# Altium schematic sheet CH32V205V-R0.SchDoc
size A3; SheetNumber: 1; SheetTotal: 1
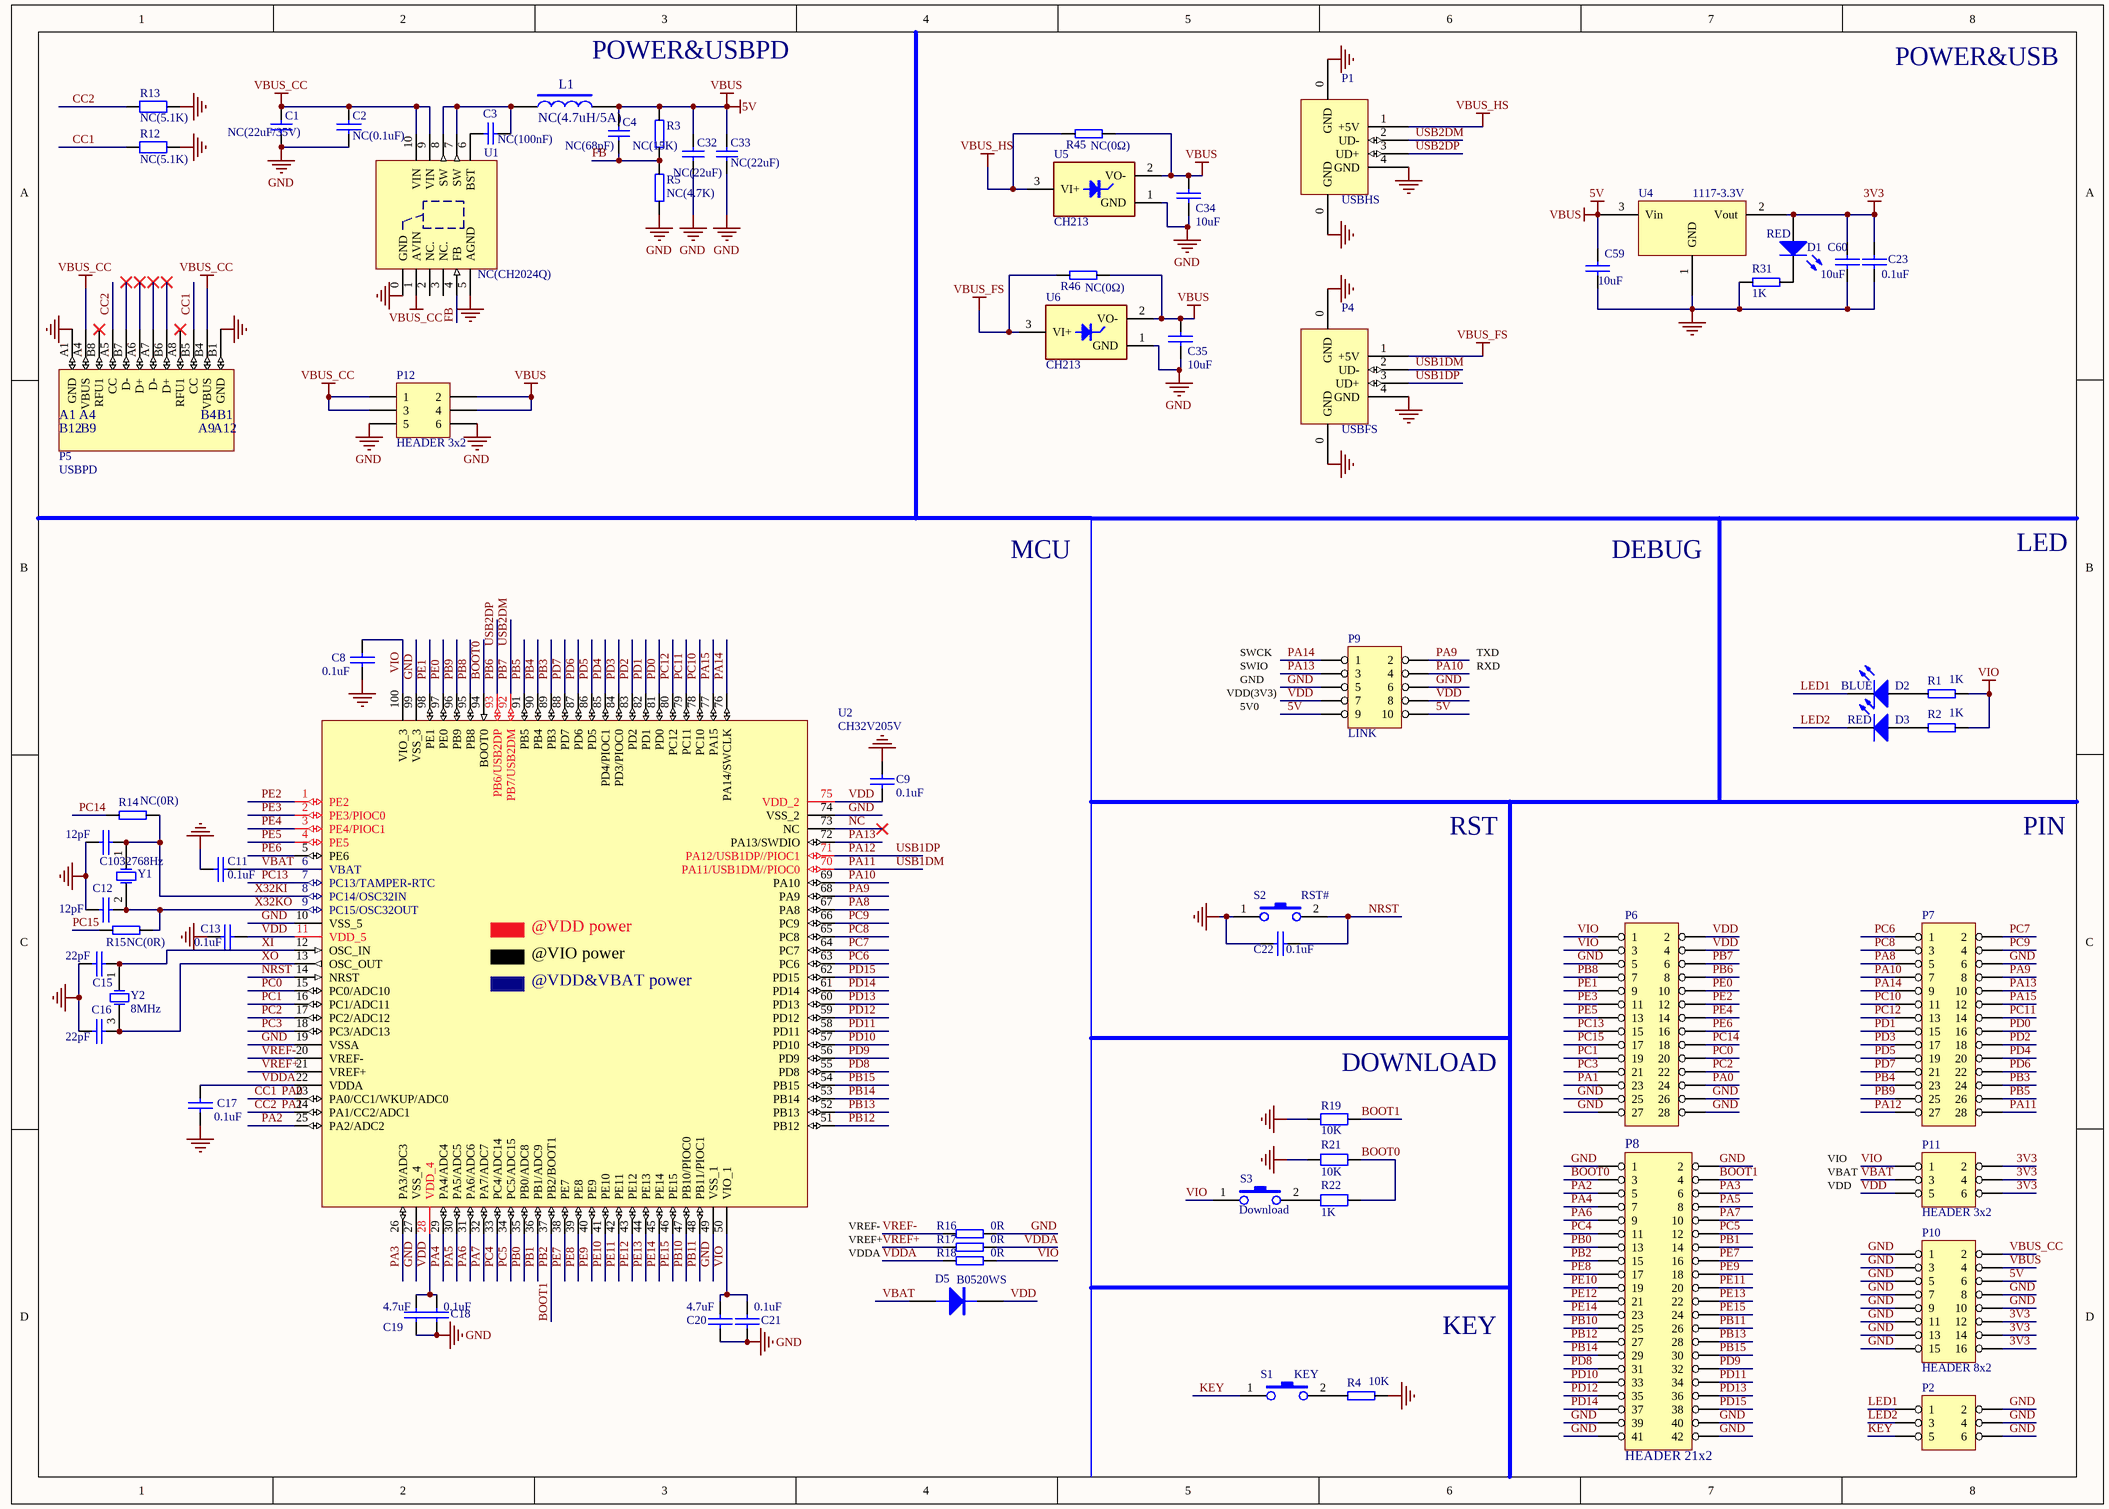
[diagram p0: CH32V205V-R0.SchDoc]

## Parts
C1  NC(22uF/35V)  [0805_C]
C2  NC(0.1uF)  [0402_C]
C3  NC(100nF)  [0402_C]
C4  NC(68pF)  [0402_C]
C8  0.1uF  [0402_C]
C9  0.1uF  [0402_C]
C10  12pF  [0402_C]
C11  0.1uF  [0402_C]
C12  12pF  [0402_C]
C13  0.1uF  [0402_C]
C15  22pF  [0402_C]
C16  22pF  [0402_C]
C17  0.1uF  [0402_C]
C18  0.1uF  [0402_C]
C19  4.7uF  [0402_C]
C20  4.7uF  [0402_C]
C21  0.1uF  [0402_C]
C22  0.1uF  [0402_C]
C23  0.1uF  [0402_C]
C32  NC(22uF)  [0805_C]
C33  NC(22uF)  [0805_C]
C34  10uF  [0603_C]
C35  10uF  [0603_C]
C59  10uF  [0603_C]
C60  10uF  [0603_C]
D1  RED  [0603+]
D2  BLUE  [0603+]
D3  RED  [0603+]
D5  B0520WS  [SOD-323]
L1  NC(4.7uH/5A)  [IND-SMD_L7.0-W6.6]
P1  USBHS  [USBAF]
P2  IO  [IDC6-2.54mm]  (value not drawn)
P4  USBFS  [USBAF]
P5  USBPD  [TYPE-C-Receptacle-2.0]
P6  (no value)  [IDC28-2.54MM]
P7  (no value)  [IDC28-2.54MM]
P8  HEADER 21x2  [IDC42-2.54MM]
P9  LINK  [IDC10-2.54mm]
P10  HEADER 8x2  [IDC16-2.54mm]
P11  HEADER 3x2  [IDC6-2.54mm]
P12  HEADER 3x2  [IDC6-2.54mm]
R1  1K  [0402]
R2  1K  [0402]
R3  NC(15K)  [0402]
R4  10K  [0402]
R5  NC(4.7K)  [0402]
R12  NC(5.1K)  [0402]
R13  NC(5.1K)  [0402]
R14  NC(0R)  [0402]
R15  NC(0R)  [0402]
R16  0R  [0402]
R17  0R  [0402]
R18  0R  [0402]
R19  10K  [0402]
R21  10K  [0402]
R22  1K  [0402]
R31  1K  [0402]
R45  NC(0Ω)  [0402]
R46  NC(0Ω)  [0402]
S1  KEY  [SMD_6.1x3.65x2.5mm-KEY]
S2  RST#  [SMD_6.1x3.65x2.5mm-KEY]
S3  Download  [SMD_6.1x3.65x2.5mm-KEY]
U1  NC(CH2024Q)  [DFN10_3X3]
U2  CH32V205V  [LQFP100]
U4  1117-3.3V  [SOT-223]
U5  CH213  [SOT-23-3]
U6  CH213  [SOT-23-3]
Y1  32768Hz  [FC-135]
Y2  8MHz  [XT3225]

## Nets
3V3: C23.1 C60.1 D1.1(A) P10.12 P10.14 P10.16 P11.2 P11.4 P11.6 U4.2(Vout)
5V: C4.1 C32.2 C33.2 C34.1 C35.1 C59.1 L1.2 P9.9 P9.10 P10.4 P10.6 P12.2 P12.4 R3.2 R45.1 R46.1 U4.3(Vin) U5.2(VO-) U6.2(VO-)  [also labelled VBUS]
GND: C1.1 C2.1 C8.1 C9.2 C10.1 C11.1 C12.1 C13.2 C15.1 C16.1 C17.2 C18.1 C19.2 C20.2 C21.2 C22.1 C23.2 C32.1 C33.1 C34.2 C35.2 C59.2 C60.2 P1.0(GND) P1.4(GND) P2.2 P2.4 P2.6 P4.0(GND) P4.4(GND) P5.A1(GND) P5.B1(GND) P6.5 P6.25 P6.26 P6.27 P6.28 P7.6 P8.1 P8.2 P8.39 P8.40 P8.41 P8.42 P9.5 P9.6 P10.1 P10.3 P10.5 P10.7 P10.8 P10.9 P10.10 P10.11 P10.13 P10.15 P12.5 P12.6 R4.1 R5.1 R12.2 R13.2 R16.1 R19.2 R21.2 R31.1 S2.1 U1.0(GND) U1.5(AGND) U2.10(VSS_5) U2.19(VSSA) U2.27(VSS_4) U2.49(VSS_1) U2.74(VSS_2) U2.99(VSS_3) U4.1(GND) U5.1(GND) U6.1(GND)
VBUS_CC: C1.2 C2.2 P5.A4(VBUS) P5.B4(VBUS) P10.2 P12.1 P12.3 U1.1(AVIN) U1.9(VIN) U1.10(VIN)
VBUS_FS: P4.1(+5V) R46.2 U6.3(VI+)
VBUS_HS: P1.1(+5V) R45.2 U5.3(VI+)
VIO: C8.2 C20.1 C21.1 P6.1 P6.3 P11.1 R1.1 R2.1 R18.1 S3.1 U2.50(VIO_1) U2.100(VIO_3)
BOOT0: P8.3 R21.1 R22.1 U2.94(BOOT0)
BOOT1: P8.4 P8.15 R19.1 U2.37(PB2/BOOT1)  [also labelled PB2]
CC1: P5.B5(CC) P6.24 R12.1 U2.23(PA0/CC1/WKUP/ADC0)  [also labelled PA0]
CC2: P5.A5(CC) P6.23 R13.1 U2.24(PA1/CC2/ADC1)  [also labelled PA1]
FB: C4.2 R3.1 R5.2 U1.4(FB)
KEY: P2.5 S1.1
LED1: D2.2(K) P2.1
LED2: D3.2(K) P2.3
NC: U2.73(NC)
NRST: C22.2 S2.2 U2.14(NRST)
PA2: P8.5 U2.25(PA2/ADC2)
PA3: P8.6 U2.26(PA3/ADC3)
PA4: P8.7 U2.29(PA4/ADC4)
PA5: P8.8 U2.30(PA5/ADC5)
PA6: P8.9 U2.31(PA6/ADC6)
PA7: P8.10 U2.32(PA7/ADC7)
PA8: P7.5 U2.67(PA8)
PA9: P7.8 P9.2 U2.68(PA9)
PA10: P7.7 P9.4 U2.69(PA10)
PA11: P4.2(UD-) P7.28 U2.70(PA11/USB1DM//PIOC0)  [also labelled USB1DM]
PA12: P4.3(UD+) P7.27 U2.71(PA12/USB1DP//PIOC1)  [also labelled USB1DP]
PA13: P7.10 P9.3 U2.72(PA13/SWDIO)
PA14: P7.9 P9.1 U2.76(PA14/SWCLK)
PA15: P7.12 U2.77(PA15)
PB0: P8.13 U2.35(PB0/ADC8)
PB1: P8.14 U2.36(PB1/ADC9)
PB3: P7.24 U2.89(PB3)
PB4: P7.23 U2.90(PB4)
PB5: P7.26 U2.91(PB5)
PB6: P1.3(UD+) P6.8 U2.93(PB6/USB2DP)  [also labelled USB2DP]
PB7: P1.2(UD-) P6.6 U2.92(PB7/USB2DM)  [also labelled USB2DM]
PB8: P6.7 U2.95(PB8)
PB9: P7.25 U2.96(PB9)
PB10: P8.25 U2.47(PB10/PIOC0)
PB11: P8.26 U2.48(PB11/PIOC1)
PB12: P8.27 U2.51(PB12)
PB13: P8.28 U2.52(PB13)
PB14: P8.29 U2.53(PB14)
PB15: P8.30 U2.54(PB15)
PC0: P6.20 U2.15(PC0/ADC10)
PC1: P6.19 U2.16(PC1/ADC11)
PC2: P6.22 U2.17(PC2/ADC12)
PC3: P6.21 U2.18(PC3/ADC13)
PC4: P8.11 U2.33(PC4/ADC14)
PC5: P8.12 U2.34(PC5/ADC15)
PC6: P7.1 U2.63(PC6)
PC7: P7.2 U2.64(PC7)
PC8: P7.3 U2.65(PC8)
PC9: P7.4 U2.66(PC9)
PC10: P7.11 U2.78(PC10)
PC11: P7.14 U2.79(PC11)
PC12: P7.13 U2.80(PC12)
PC13: P6.15 U2.7(PC13/TAMPER-RTC)
PC14: P6.18 R14.1
PC15: P6.17 R15.1
PD0: P7.16 U2.81(PD0)
PD1: P7.15 U2.82(PD1)
PD2: P7.18 U2.83(PD2)
PD3: P7.17 U2.84(PD3/PIOC0)
PD4: P7.20 U2.85(PD4/PIOC1)
PD5: P7.19 U2.86(PD5)
PD6: P7.22 U2.87(PD6)
PD7: P7.21 U2.88(PD7)
PD8: P8.31 U2.55(PD8)
PD9: P8.32 U2.56(PD9)
PD10: P8.33 U2.57(PD10)
PD11: P8.34 U2.58(PD11)
PD12: P8.35 U2.59(PD12)
PD13: P8.36 U2.60(PD13)
PD14: P8.37 U2.61(PD14)
PD15: P8.38 U2.62(PD15)
PE0: P6.10 U2.97(PE0)
PE1: P6.9 U2.98(PE1)
PE2: P6.12 U2.1(PE2)
PE3: P6.11 U2.2(PE3/PIOC0)
PE4: P6.14 U2.3(PE4/PIOC1)
PE5: P6.13 U2.4(PE5)
PE6: P6.16 U2.5(PE6)
PE7: P8.16 U2.38(PE7)
PE8: P8.17 U2.39(PE8)
PE9: P8.18 U2.40(PE9)
PE10: P8.19 U2.41(PE10)
PE11: P8.20 U2.42(PE11)
PE12: P8.21 U2.43(PE12)
PE13: P8.22 U2.44(PE13)
PE14: P8.23 U2.45(PE14)
PE15: P8.24 U2.46(PE15)
VBAT: C11.2 D5.1(A) P11.3 U2.6(VBAT)
VDD: C9.1 C13.1 C18.2 C19.1 D5.2(K) P6.2 P6.4 P9.7 P9.8 P11.5 U2.11(VDD_5) U2.28(VDD_4) U2.75(VDD_2)
VDDA: C17.1 R17.1 R18.2 U2.22(VDDA)
VREF+: R17.2 U2.21(VREF+)
VREF-: R16.2 U2.20(VREF-)
X32KI: C10.2 R14.2 U2.8(PC14/OSC32IN) Y1.1(OSC1)
X32KO: C12.2 R15.2 U2.9(PC15/OSC32OUT) Y1.2(OSC2)
XI: C15.2 U2.12(OSC_IN) Y2.1(OSC1)
XO: C16.2 U2.13(OSC_OUT) Y2.3(OSC2)
NetC3_1: C3.1 U1.6(BST)
NetC3_2: C3.2 L1.1 U1.7(SW) U1.8(SW)
NetD1_2: D1.2(K) R31.2
NetD2_1: D2.1(A) R1.2
NetD3_1: D3.1(A) R2.2
NetR4_2: R4.2 S1.2
NetR22_2: R22.2 S3.2

Not connected (* = marked no-connect by the designer): P5 A6(D+)* A7(D-)* A8(RFU1)* B6(D+)* B7(D-)* B8(RFU1)*; U1 2(NC.) 3(NC.)

## Notes on the sheet
- POWER&USBPD
- POWER&USB
- MCU
- DEBUG
- LED
- VDD(3V3)
- SWCK
- SWIO
- 5V0
- GND
- TXD
- RXD
- RST
- PIN
- (near R19) DOWNLOAD
- VIO
- VBAT
- VDD
- (near U2) VREF-
- (near U2) VREF+
- VDDA
- KEY
- (in symbol CH32V205V) @VDD power; @VIO power; @VDD&VBAT power
- (in symbol TYPE-C1) B12; B9; A9; A12

## Library data of the parts
C1 C4 C32 C33 = 0603 100nF (104) 10% 50V: 贴片电容; ComponentLink1Description: 供应商链接; ComponentLink1URL: http://www.szlcsc.com/product/details_15331.html; Package: 0603; Supplier: LC; SuppliersPartNumber: C14663
C2 C8-C13 C15-C23 C34 C35 C59 C60 = CAP: Capacitor
C3 = 0603 1uF (105) 10% 50V: 贴片电容; ComponentLink1Description: 供应商链接; ComponentLink1URL: http://www.szlcsc.com/product/details_16531.html; Package: 0603; Supplier: LC; SuppliersPartNumber: C15849
D1-D3 = LED0: Typical INFRARED GaAs LED; Published: 8-Jun-2000; LatestRevisionDate: 08-Jul-2005; LatestRevisionNote: Mech Layer 1 removed.; PackageReference: LED-0; Publisher: Altium Limited; PackageDescription: LED; 2 Leads
D5 = DIODE
L1 = INDUCTOR
P1 P4 = USB: USB Port
P2 P11 P12 = HEADER 3x2: Header, 3-Pin, Dual row
P5 = TYPE-C1
P6 P7 = HEADER 14x2: Header, 14-Pin, Dual row
P8 = HEADER 21x2: Header, 21-Pin, Dual row
P9 = HEADER 5x2: Header, 5-Pin, Dual row
P10 = HEADER 8x2: Header, 8-Pin, Dual row
R1-R5 R14 R15 R31 R45 R46 = RES
R12 R13 R19 R21 R22 = Res2: Resistor
  R19 R21: Published: 8-Jun-2000; LatestRevisionDate: 17-Jul-2002; LatestRevisionNote: Re-released for DXP Platform.; PackageReference: AXIAL-0.4; Publisher: Altium Limited; Value: 10K
  R22: Published: 8-Jun-2000; LatestRevisionDate: 17-Jul-2002; LatestRevisionNote: Re-released for DXP Platform.; PackageReference: AXIAL-0.4; Publisher: Altium Limited
R16-R18 = R
S1-S3 = KEY1
U1 = CH2024Q: Step-Down DC-DC Converter, 28V input, FB 1.2V, 3A output
U2 = CH32V205V: RISC-V MCU, 192MHz, USB_480M, USB FS, PD, PIOC, ADC, TKEY, 2*OPA, 2*CMP
U5 U6 = CH213E: Ideal Diode 5V*1A
Y1 Y2 = XTAL: Crystal Oscillator; Published: 8-Jun-2000; LatestRevisionDate: 17-Jul-2002; LatestRevisionNote: Re-released for DXP Platform.; PackageReference: R38; Publisher: Altium Limited; PackageDescription: Crystal, Thru-Hole; 2 Leads; Body 3.1 x 8.2 mm (Dia.xH)